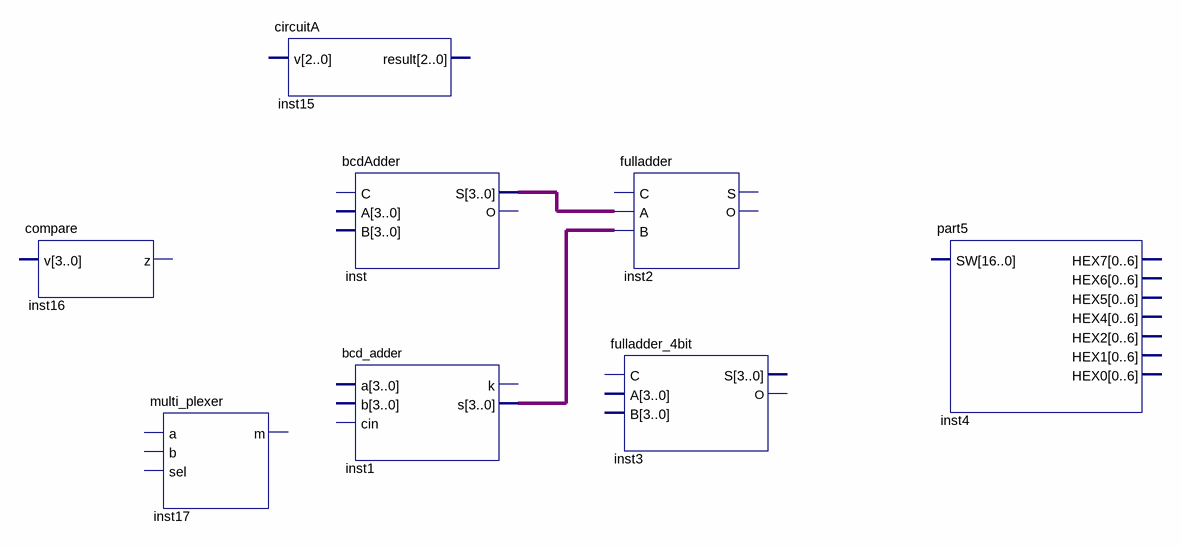
[diagram p0: schematic sheet]
// Quartus schematic ZHSY2_Poj.bdf as structural Verilog: 8 symbols, 0 pins
module ZHSY2_Poj (
);

  wire [3:0] inst1_s, inst_s;

  compare inst16 ();  // open: v, z
  multi_plexer inst17 ();  // open: a, b, sel, m
  circuitA inst15 ();  // open: v, result
  bcdAdder inst (.S(inst_s));  // open: C, A, B, O
  bcd_adder inst1 (.s(inst1_s));  // open: a, b, cin, k
  fulladder inst2 (.A(inst_s), .B(inst1_s));  // open: C, S, O
  fulladder_4bit inst3 ();  // open: C, A, B, S, O
  part5 inst4 ();  // open: SW, HEX7, HEX6, HEX5, HEX4, HEX2, HEX1, HEX0
endmodule
